# EAGLE design RPi BUS-Controller V1.0 (EAGLE 6.1)
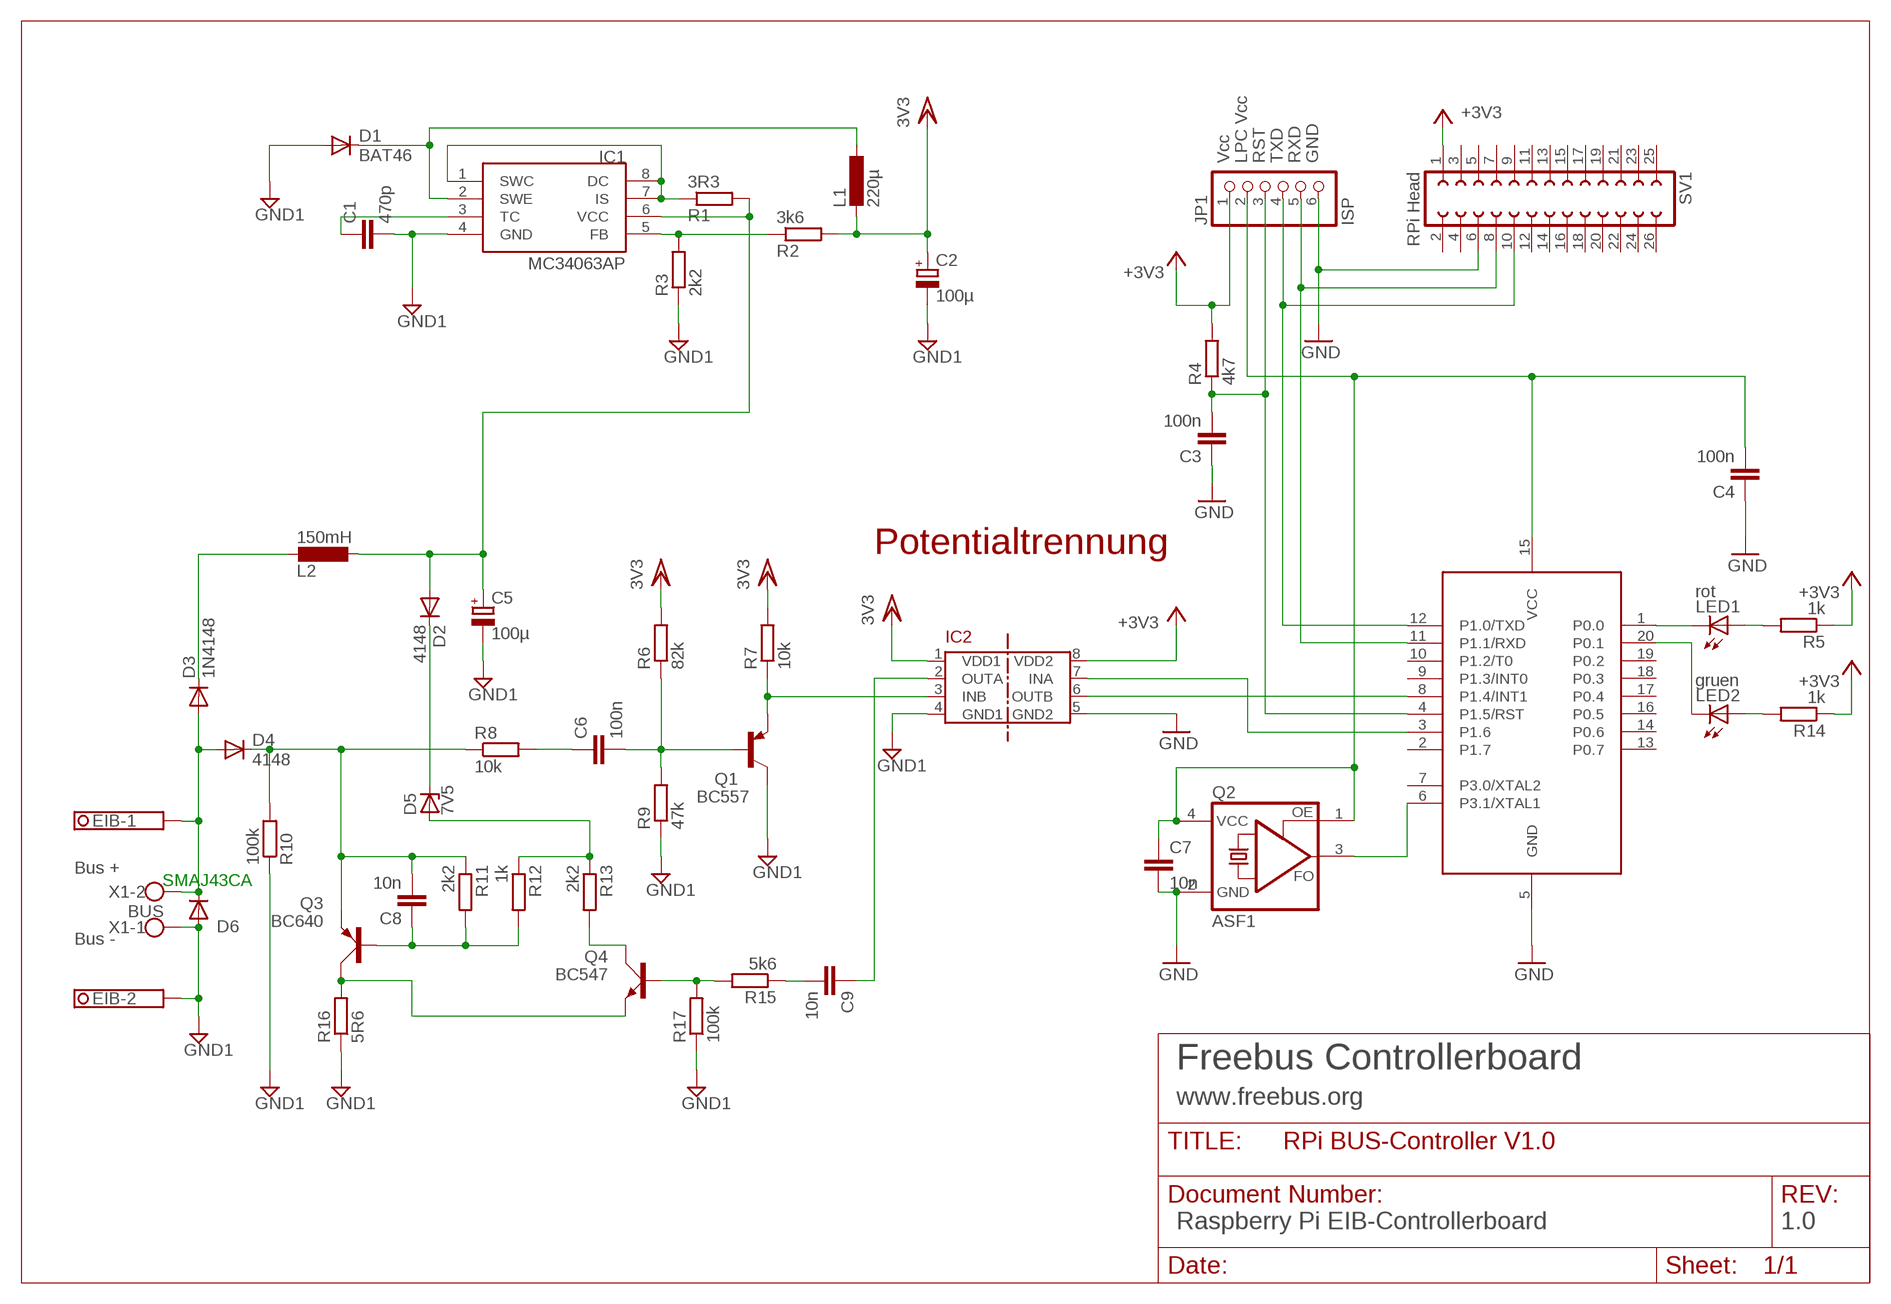
[diagram p0: schematic, sheet 1]

## Parts
C1  470p  C-EU025-024X044  [C025-024X044]
C2  100µ  RCL_C_EU_H2-5X11  [2-5X11]
C3  100n  C-EU025-024X044  [C025-024X044]
C4  100n  C-EU025-024X044  [C025-024X044]
C5  100µ  RCL_C_EU_H3,5-8X13  [3,5-8X13]
C6  100n  C-EU025-024X044  [C025-024X044]
C7  10n  C-EU025-024X044  [C025-024X044]
C8  10n  C-EU025-024X044  [C025-024X044]
C9  10n  C-EU025-024X044  [C025-024X044]
D1  BAT46  1N4148DO35-7  [DO35-7]
D2  4148  1N4148DO35-7  [DO35-7]
D3  1N4148  1N4148DO35-7  [DO35-7]
D4  4148  1N4148DO35-7  [DO35-7]
D5  7V5  ZPD"  [DO35Z7]
D6  SMAJ43CA  D-SMB  [SMB]
EIB  1751248  [1751248]
IC1  MC34063AP  [DIL08]
IC2  ADUM1201  [SO8]
IC3  89LPC922  [DIL20]
JP1  ISP  PINHD-1X6  [1X06]
L1  220µ  L-EU0207/12  [0207/12]
L2  150mH  RCL_L-11P11PH  [RCL_11PH]
LED1  rot  LED3MM  [LED3MM]
LED2  gruen  LED3MM  [LED3MM]
Q1  BC557  [TO92]
Q2  ASF1  [ASF]
Q3  BC640  [SOT54D]
Q4  BC547  [SOT54A]
R1  3R3  R-EU_0207/7  [0207/7]
R2  3k6  R-EU_0207/7  [0207/7]
R3  2k2  R-EU_0207/7  [0207/7]
R4  4k7  R-EU_0207/7  [0207/7]
R5  1k  R-EU_0207/7  [0207/7]
R6  82k  R-EU_0207/7  [0207/7]
R7  10k  R-EU_0207/7  [0207/7]
R8  10k  R-EU_0207/7  [0207/7]
R9  47k  R-EU_0207/7  [0207/7]
R10  100k  R-EU_0207/7  [0207/7]
R11  2k2  R-EU_0207/7  [0207/7]
R12  1k  R-EU_0207/7  [0207/7]
R13  2k2  R-EU_0207/7  [0207/7]
R14  1k  R-EU_0207/7  [0207/7]
R15  5k6  R-EU_0207/7  [0207/7]
R16  5R6  R-EU_0207/7  [0207/7]
R17  100k  R-EU_0207/7  [0207/7]
SV1  RPi Head  FE13-2  [FE13-2]
X1  BUS  W237-02P  [W237-132]

## Nets
/RESET: C3.2 IC3.4(P1.5/RST) JP1.3 R4.1
BASE: C6.2 Q1.2(B) R6.1 R9.2
EIB+: D3.A D4.A D6.1(C) EIB.1 X1.2
FETGATE: Q4.B R15.2 R17.2
GND1: C1.2 C2.- C5.- D1.A D6.2(A) EIB.2 IC1.4(GND) IC2.4(GND1) Q1.3(C) R3.1 R9.1 R10.1 R16.1 R17.1 X1.1
GND2: C3.1 C4.1 C7.2 IC2.5(GND2) IC3.5(GND) JP1.6 Q2.2(GND) SV1.6 ; supply symbol labelled GND
N$1: Q4.C R13.2
N$2: IC2.3(INB) Q1.1(E) R7.1
N$3: IC3.6(P3.1/XTAL1) Q2.3(FO)
N$4: D2.C D5.C
N$7: IC2.7(INA) IC3.3(P1.6)
N$8: IC1.1(SWC) IC1.7(IS) IC1.8(DC) R1.1
N$10: IC3.1(P0.0) LED1.K(C)
N$11: IC1.5(FB) R2.1 R3.2
N$12: D1.C IC1.2(SWE) L1.1
N$13: D3.C L2.P$2
N$14: C1.1 IC1.3(TC)
N$16: C6.1 R8.2
N$17: C9.2 R15.1
N$18: Q3.C Q4.E R16.2
N$19: IC3.20(P0.1) LED2.K(C)
N$20: C9.1 IC2.2(OUTA)
N$21: LED2.A R14.2
N$25: D5.A R12.1 R13.1
N$28: C8.1 Q3.B R11.2 R12.2
N$29: IC3.12(P1.0/TXD) JP1.4 SV1.10
N$30: IC3.11(P1.1/RXD) JP1.5 SV1.8
N$41: LED1.A R5.2
SIGIN: IC2.6(OUTB) IC3.8(P1.4/INT1)
V+: C8.2 D4.C Q3.E R8.1 R10.2 R11.1
VCC: C4.2 C7.1 IC3.15(VCC) JP1.2 Q2.1(OE) Q2.4(VCC)
VDC: C5.+ D2.A IC1.6(VCC) L2.P$1 R1.2
VDD1: C2.+ IC2.1(VDD1) L1.2 R2.2 R6.2 R7.2 ; supply symbol labelled 3V3
VDD2: IC2.8(VDD2) JP1.1 R4.2 R5.1 R14.1 SV1.1 ; supply symbol labelled +3V3
Unconnected: IC3.2(P1.7) IC3.7(P3.0/XTAL2) IC3.9(P1.3/INT0) IC3.10(P1.2/T0) IC3.13(P0.7) IC3.14(P0.6) IC3.16(P0.5) IC3.17(P0.4) IC3.18(P0.3) IC3.19(P0.2) SV1.2 SV1.3 SV1.4 SV1.5 SV1.7 SV1.9 SV1.11 SV1.12 SV1.13 SV1.14 SV1.15 SV1.16 SV1.17 SV1.18 SV1.19 SV1.20 SV1.21 SV1.22 SV1.23 SV1.24 SV1.25 SV1.26

## Notes on the sheet
- Vcc | LPC Vcc | RST | TXD | RXD | GND
- Potentialtrennung
- Bus + | SMAJ43CA
- Bus -
- Freebus Controllerboard
- www.freebus.org
- Raspberry Pi EIB-Controllerboard | 1.0

## Library data of the parts
C1 C3 C4 C6-C9 = rcl:C-EU: CAPACITOR, European symbol
C2 C5 = LPC_Gira3:RCL_C_EU_H
D1-D4 = diode:1N4148: DIODE high speed (Philips)
D5 = diode:ZPD: Z DIODE 500 mW
D6 = semicon-smd-ipc:D-: DIODE unfilled
EIB = con-phoenix-350:1751248: MKDS 1/ 2-3,5 Printklemme Nennstrom: 10 A Bemessungsspannung: 160 V Raster: 3,5 mm Polzahl: 2 Montageart: Löten Anschlussart: Schraubanschluss Anschlussrichtung vom Leiter zur Platine: 0° Source: http://eshop.phoenixcontact.com .. 1751248.pdf
IC1 = mc34063:MC34063
IC2 = Bus-isolators:ADUM1201
IC3 = micro-philips:89LPC922
JP1 = pinhead:PINHD-1X6: PIN HEADER
L1 = rcl:L-EU: INDUCTOR, European symbol
L2 = LPC_Gira3:RCL_L-11P
LED1 LED2 = led:LED: LED OSRAM: - CHIPLED LG R971, LG N971, LY N971, LG Q971, LY Q971, LO R971, LY R971 LH N974, LH R974 LS Q976, LO Q976, LY Q976 LO Q996 - Hyper CHIPLED LW Q18S LB Q993, LB Q99A, LB R99A - SideLED LS A670, LO A670, LY A670, LG A670, LP A670 LB A673, LV A673, LT A673, LW A673 LH A674 LY A675 LS A676, LA A676, LO A676, LY A676, LW A676 LS A679, LY A679, LG A679 - Hyper Micro SIDELED® LS Y876, LA Y876, LO Y876, LY Y876 LT Y87S - SmartLED LW L88C, LW L88S LB L89C, LB L89S, LG L890 LS L89K, LO L89K, LY L89K LS L896, LA L896, LO L896, LY L896 - TOPLED LS T670, LO T670, LY T670, LG T670, LP T670 LSG T670, LSP T670, LSY T670, LOP T670, LYG T670 LG T671, LOG T671, LSG T671 LB T673, LV T673, LT T673, LW T673 LH T674 LS T676, LA T676, LO T676, LY T676, LB T676, LH T676, LSB T676, LW T676 LB T67C, LV T67C, LT T67C, LS T67K, LO T67K, LY T67K, LW E67C LS E67B, LA E67B, LO E67B, LY E67B, LB E67C, LV E67C, LT E67C LW T67C LS T679, LY T679, LG T679 LS T770, LO T770, LY T770, LG T770, LP T770 LB T773, LV T773, LT T773, LW T773 LH T774 LS E675, LA E675, LY E675, LS T675 LS T776, LA T776, LO T776, LY T776, LB T776 LHGB T686 LT T68C, LB T68C - Hyper Mini TOPLED® LB M676 - Mini TOPLED Santana® LG M470 LS M47K, LO M47K, LY M47K Source: http://www.osram.convergy.de - LUMILED® LXK2-PW12-R00, LXK2-PW12-S00, LXK2-PW14-U00, LXK2-PW14-V00 LXK2-PM12-R00, LXK2-PM12-S00, LXK2-PM14-U00 LXK2-PE12-Q00, LXK2-PE12-R00, LXK2-PE12-S00, LXK2-PE14-T00, LXK2-PE14-U00 LXK2-PB12-K00, LXK2-PB12-L00, LXK2-PB12-M00, LXK2-PB14-N00, LXK2-PB14-P00, LXK2-PB14-Q00 LXK2-PR12-L00, LXK2-PR12-M00, LXK2-PR14-Q00, LXK2-PR14-R00 LXK2-PD12-Q00, LXK2-PD12-R00, LXK2-PD12-S00 LXK2-PH12-R00, LXK2-PH12-S00 LXK2-PL12-P00, LXK2-PL12-Q00, LXK2-PL12-R00 Source: www.luxeon.com
Q1 = transistor-pnp:BC557: PNP Transistor
Q2 = crystal:ASF*: CRYSTAL CLOCK OSCILLATORS 5.0 Vdc or 3.3 Vdc - LOW PROFILE ULTRA MINIATURE CERAMIC SURFACE MOUNT Source: http://www.abracon.com/Oscillators/asf1-L-L1.pdf
Q3 = transistor-small-signal:BC640: PNP TRANSISTOR
Q4 = transistor-small-signal:BC547: NPN TRANSISTOR
R1-R17 = rcl:R-EU_: RESISTOR, European symbol
SV1 = con-lsta:FE13-2: FEMALE HEADER
X1 = con-wago-508:W237-02P: WAGO SREW CLAMP

## Board
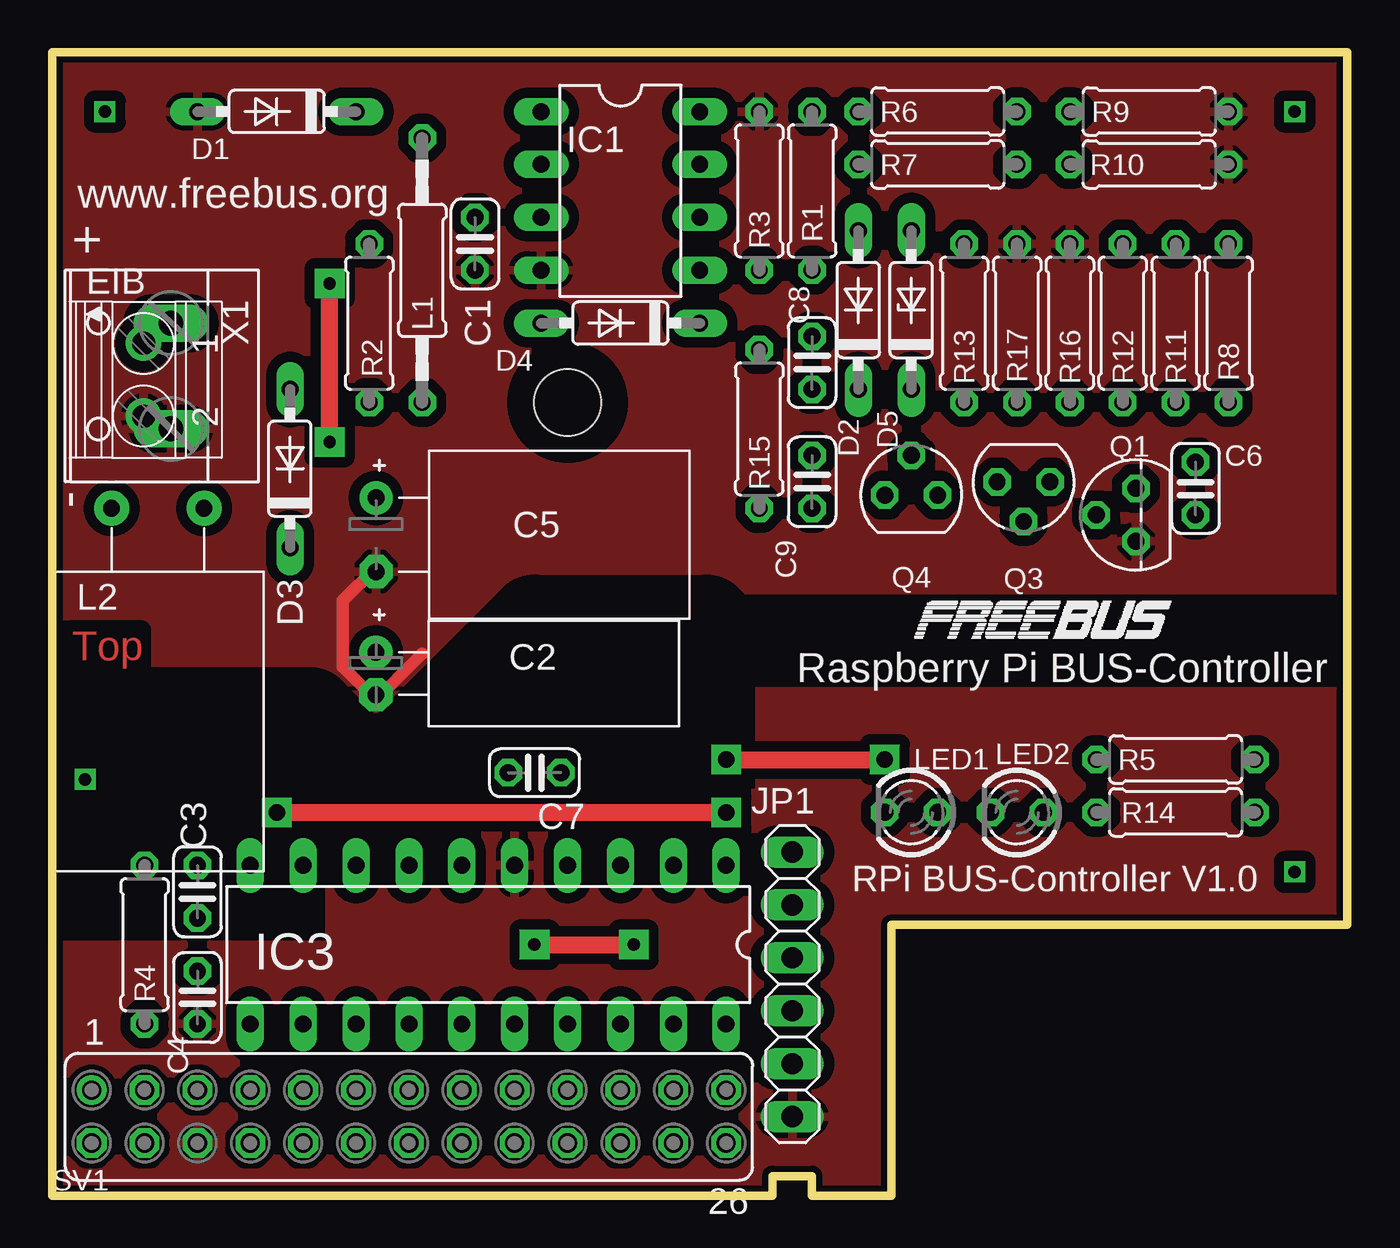
[diagram p1: board, top side]
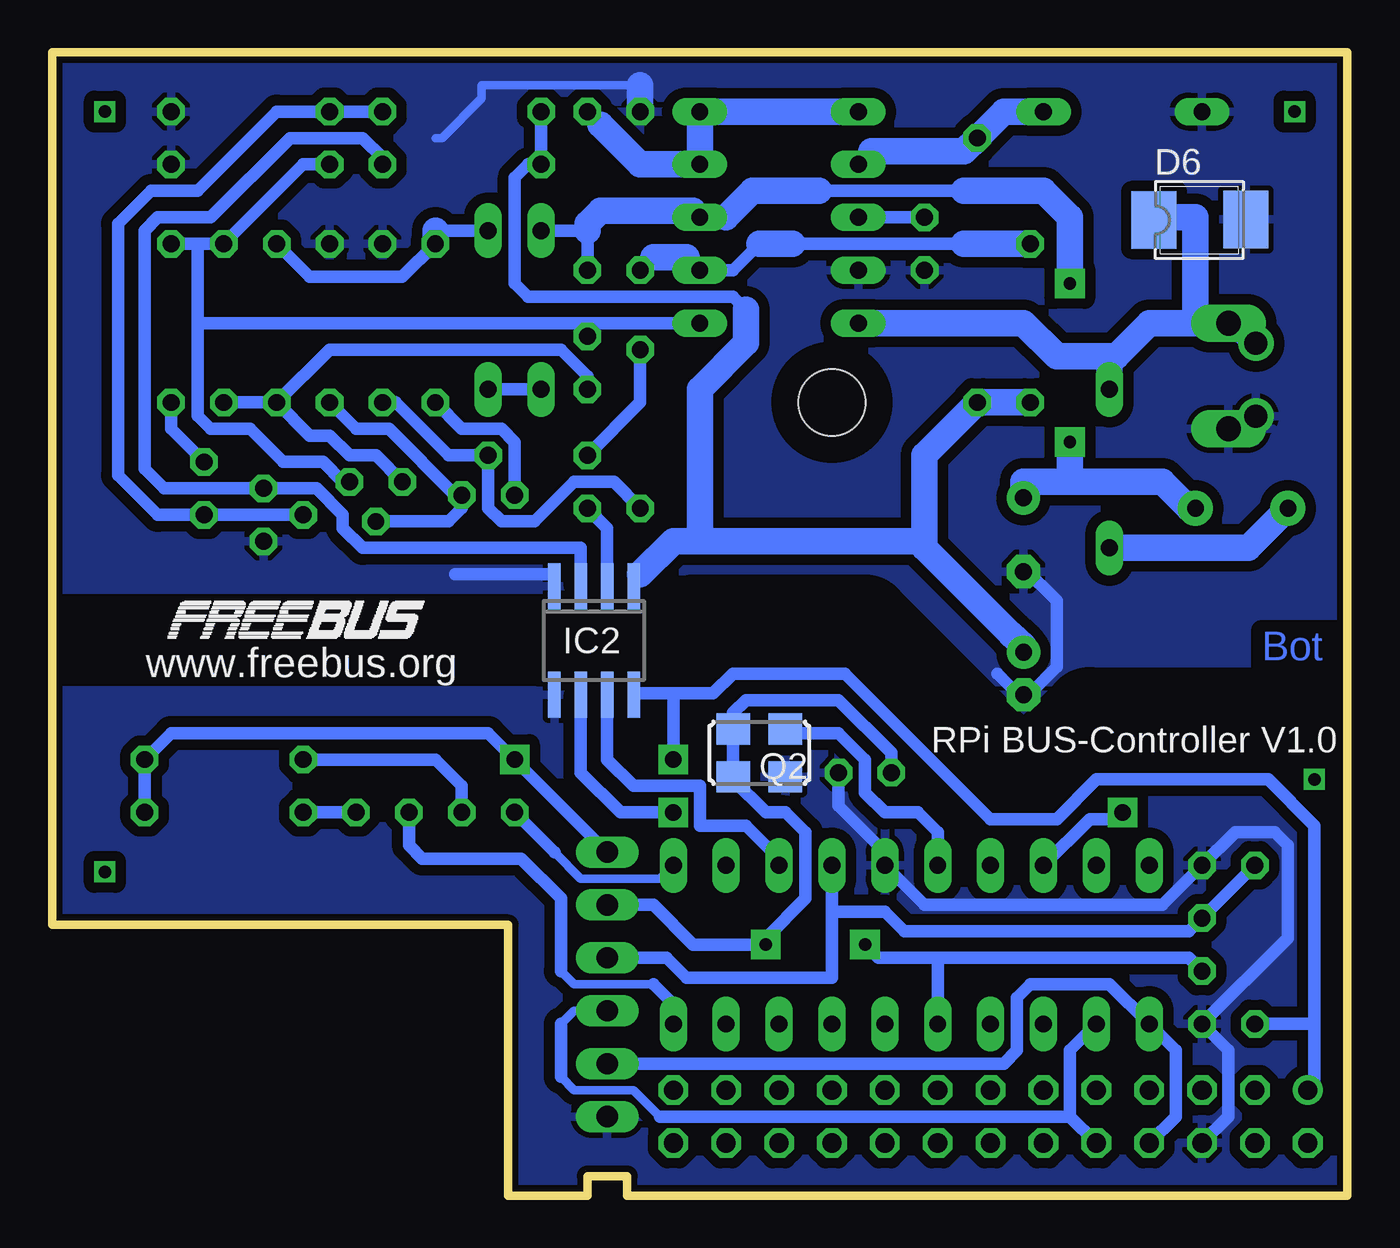
[diagram p2: board, bottom side, seen from below]

Size 62.23 x 54.93 mm. Coordinates in mm from the lower left corner, seen from the top.
Outline: 0,0 34.61,0 34.61,0.95 36.51,0.95 36.51,0 40.32,0 40.32,13.02 62.23,13.02 62.23,54.93 0,54.93 0,0
Copper layers (1*16): Top 0.035mm / dielectric 1.5mm / Bottom 0.035mm
Design rules: minimum track width 16mil, minimum drill 24mil, track to track 20mil, track to pad 10mil, pad to pad 10mil, via to via 10mil, smd to smd 10mil, copper to edge 4mil, drill to drill 8mil, minimum pad ring 10mil, minimum via ring 8mil, stop-mask expansion 4mil, vias tented up to drill 0mil, thermal gap 10mil
Holes 3.2 mm at 24.77,38.1
tRestrict: area 22.7,36 to 26.9,40.2; 7 lines
bRestrict: area 22.7,36 to 26.9,40.2; 8 lines
vRestrict: area 36.8,45.7 to 53.3,55.9; area 57.1,33 to 64.8,55.9; area 10.2,45.7 to 16.5,52.1; area 10.2,16.5 to 15.2,39.4

### Footprints (pad centres in the part's own frame; a part is rotated, then mirrored left to right if it is on the bottom)
C025-024X044 = drill 0.813 octagon: 1 -1.27,0; 2 1.27,0
2-5X11 = drill 0.813 pad 1.6: + -1.02,0 | drill 0.813 pad 1.6 octagon: - 1.02,0
3,5-8X13 = drill 0.813 pad 1.6: + -1.77,-0.31 | drill 0.813 pad 1.6 octagon: - 1.77,-0.31
DO35-7 = drill 0.813 long: A 3.81,0; C -3.81,0
DO35Z7 = drill 0.813 long: A 3.81,0; C -3.81,0
SMB = smd 2.159 x 2.743: 1 -2.311,-0.127; 2 2.108,-0.102
1751248 = drill 1.1 pad 1.7: 1 -1.75,-0.1; 2 1.75,-0.1
DIL08 = drill 0.813 long: 1 -3.81,-3.81; 2 -1.27,-3.81; 3 1.27,-3.81; 4 3.81,-3.81; 5 3.81,3.81; 6 1.27,3.81; 7 -1.27,3.81; 8 -3.81,3.81
SO8 = smd 0.6 x 2.2: 1 -1.905,-2.6; 2 -0.635,-2.6; 3 0.635,-2.6; 4 1.905,-2.6; 5 1.905,2.6; 6 0.635,2.6; 7 -0.635,2.6; 8 -1.905,2.6
DIL20 = drill 0.813 long: 1 -11.43,-3.81; 2 -8.89,-3.81; 3 -6.35,-3.81; 4 -3.81,-3.81; 5 -1.27,-3.81; 6 1.27,-3.81; 7 3.81,-3.81; 8 6.35,-3.81; 9 8.89,-3.81; 10 11.43,-3.81; 11 11.43,3.81; 12 8.89,3.81; 13 6.35,3.81; 14 3.81,3.81; 15 1.27,3.81; 16 -1.27,3.81; 17 -3.81,3.81; 18 -6.35,3.81; 19 -8.89,3.81; 20 -11.43,3.81
1X06 = drill 1.016 long: 1 -6.35,0; 2 -3.81,0; 3 -1.27,0; 4 1.27,0; 5 3.81,0; 6 6.35,0
0207/12 = drill 0.813 octagon: 1 -6.35,0; 2 6.35,0
RCL_11PH = drill 0.8 pad 1.676: P$1 -2.223,0; P$2 2.223,0
LED3MM = drill 0.813 octagon: A -1.27,0; K 1.27,0
TO92 = drill 0.813 octagon: 1 1.27,0; 2 0,1.905; 3 -1.27,0
ASF = smd 1.6 x 1.5: 1 -1.25,-1.15; 2 1.25,-1.15; 3 1.25,1.15; 4 -1.25,1.15
SOT54D = drill 0.813 octagon: B 1.27,0; C 0,1.905; E -1.27,0
SOT54A = drill 0.813 octagon: B 0,1.905; C -1.27,0; E 1.27,0
0207/7 = drill 0.813 octagon: 1 -3.81,0; 2 3.81,0
FE13-2 = drill 0.914: 1 -15.24,1.27 | drill 0.914 octagon: 2 -15.24,-1.27; 3 -12.7,1.27; 4 -12.7,-1.27; 5 -10.16,1.27; 6 -10.16,-1.27; 7 -7.62,1.27; 8 -7.62,-1.27; 9 -5.08,1.27; 10 -5.08,-1.27; 11 -2.54,1.27; 12 -2.54,-1.27; 13 0,1.27; 14 0,-1.27; 15 2.54,1.27; 16 2.54,-1.27; 17 5.08,1.27; 18 5.08,-1.27; 19 7.62,1.27; 20 7.62,-1.27; 21 10.16,1.27; 22 10.16,-1.27; 23 12.7,1.27; 24 12.7,-1.27; 25 15.24,1.27; 26 15.24,-1.27
W237-132 = drill 1.194 long: 1 -2.54,-0.635; 2 2.54,-0.635

### Placement (x,y rotation side)
C1  20.32,45.72 270 top
C2  15.56,25.08 270 top
C3  6.99,14.61 270 top
C4  6.99,9.53 90 top
C5  15.88,31.75 270 top
C6  54.93,33.97 270 top
C7  23.18,20.32 0 top
C8  36.51,40.01 90 top
C9  36.51,34.29 90 top
D1  10.79,52.07 180 top
D2  38.73,42.55 90 top
D3  11.43,34.92 90 top
D4  27.3,41.91 180 top
D5  41.27,42.55 90 top
D6  6.99,46.99 0 bottom
EIB  4.5,39.19 270 top
IC1  27.3,48.26 270 top
IC2  36.2,26.67 180 bottom
IC3  20.95,12.06 180 top
JP1  35.56,10.16 270 top
L1  17.78,44.45 270 top
L2  5.08,33.02 180 top
LED1  41.27,18.41 180 top
LED2  46.35,18.41 180 top
Q1  52.07,32.7 90 top
Q2  28.26,21.27 0 bottom
Q3  46.67,34.29 180 top
Q4  41.27,33.66 0 top
R1  36.51,48.26 270 top
R2  15.24,41.91 270 top
R3  33.97,48.26 270 top
R4  4.45,12.06 270 top
R5  53.98,20.95 180 top
R6  42.55,52.07 180 top
R7  42.55,49.53 180 top
R8  56.52,41.91 270 top
R9  52.7,52.07 180 top
R10  52.7,49.53 180 top
R11  53.98,41.91 270 top
R12  51.44,41.91 270 top
R13  43.81,41.91 270 top
R14  53.98,18.41 180 top
R15  33.97,36.83 270 top
R16  48.9,41.91 270 top
R17  46.35,41.91 270 top
SV1  17.14,3.81 0 top
X1  5.08,39.37 90 top

### Tracks (layer width: path | path; a pad name or v marks a point on that pad's centre or on a via)
/RESET
  Bottom 0.61: R4.1 C3.2 7.62,12.7 21.27,12.7 22.23,13.65 24.77,13.65 | 24.77,13.65 IC3.4 | JP1.3 32.7,11.43 31.75,10.48 24.77,10.48 24.77,13.65
BASE
  Bottom 0.61: Q1.2 C6.2 57.15,32.7 59.05,34.61 59.05,46.67 57.47,48.26 55.24,48.26 51.44,52.07 R9.2 R6.1
EIB+
  Bottom 0.406: 9.65,46.99 D6.1 | EIB.1 4.45,41.27 5.08,41.91 X1.2
  Bottom 1.27: 7.3,41.91 7.3,46.99 9.65,46.99 | 7.3,41.91 X1.2 5.4,41.91 4.45,40.96 | 7.3,41.91 9.53,41.91 11.11,40.32 11.43,40.32 | 11.43,40.32 D3.A | 11.43,40.32 13.97,40.32 15.56,41.91 D4.A
FETGATE
  Bottom 0.61: R15.2 35.24,34.29 37.15,34.29 39.05,32.38 40.64,32.38 41.27,33.02 Q4.B 43.18,35.56 45.72,38.1 R17.2
GND1
  Top 0.61: 15.56,30.16 13.97,28.57 13.97,25.4 15.24,24.13 15.88,24.13 17.78,26.04
  Bottom 0.406: 33.97,53.34 41.59,53.34 41.59,52.7 43.5,50.8 43.81,50.8 | 15.24,24.13 C2.-
  Bottom 0.61: IC2.4 38.1,29.84 42.86,29.84 | 15.56,30.16 13.97,28.57 13.97,25.4 15.24,24.13 15.88,24.13 16.83,25.08
  Bottom 1.27: R3.1 33.97,53.34 | X1.1 5.08,36.83 4.45,37.47
  pour Bottom (isolate 0.305): 15.88,22.23 13.34,24.77 0,24.77 0,54.93 62.23,54.93 62.23,28.26 39.05,28.26 39.05,27.3 33.66,27.3 31.75,29.21 22.86,29.21
  pour Top (isolate 0.305): 0,24.77 0,54.93 62.23,54.93 62.23,28.26 32.7,28.26 31.75,29.21 22.86,29.21 15.88,22.23 13.34,24.77
GND2
  Bottom 0.406: IC3.5 22.23,16.51
  Bottom 0.61: SV1.6 5.71,3.81 5.71,6.99 C4.1 2.86,12.38 2.86,16.83 3.49,17.46 5.4,17.46 C3.1 8.89,13.97 20.32,13.97 IC3.5 | 22.23,16.51 24.45,18.73 C7.2
  pour Bottom (isolate 0.305): 0,21.59 12.06,21.59 14.61,19.05 16.83,19.05 23.81,26.04 30.8,26.04 31.75,25.08 33.02,25.08 33.02,25.72 39.05,25.72 39.05,25.08 62.23,25.08 62.23,13.02 40.32,13.02 40.32,0 36.51,0 36.51,0.95 34.61,0.95 34.61,0 0,0
  pour Top (isolate 0.305): 0,12.06 13.34,12.06 13.34,19.37 33.97,19.37 33.97,25.4 62.23,25.08 62.23,13.02 40.32,13.02 40.32,0 36.51,0 36.51,0.95 34.61,0.95 34.61,0 0,0
N$1
  Bottom 0.61: Q4.C 40.01,36.2 40.64,36.83 42.55,36.83 R13.2
N$2
  Bottom 0.61: IC2.3 36.83,31.11 47.31,31.11 48.26,32.07 48.26,32.7 49.53,33.97 Q1.1 56.83,33.97 57.78,34.92 57.78,46.35 57.15,46.99 54.61,46.99 50.8,50.8 47.31,50.8 46.35,49.85 R7.1
N$3
  Bottom 0.406: 26.81,22.23 Q2.3
  Bottom 0.61: IC3.6 19.68,17.46 20.64,18.41 22.23,18.41 23.18,19.37 23.18,20.95 24.45,22.23 26.81,22.23
N$4
  Bottom 0.61: D2.C D5.C
N$7
  Bottom 0.61: IC2.7 35.56,20.95 34.29,19.68 31.11,19.68 31.11,17.78 28.89,17.78 27.3,16.19 IC3.3
N$8
  Bottom 0.61: 35.88,51.44 R1.1
  Bottom 1.27: IC1.1 IC1.8 IC1.7 33.97,49.53 35.88,51.44
N$10
  Bottom 0.406: 38.1,16.51 36.83,15.24 33.02,15.24 IC3.1
  Bottom 0.61: LED1.K 38.1,16.51
N$11
  Bottom 0.61: 33.34,45.09 R3.2 | 31.75,45.09 IC1.5 29.53,44.45 28.26,45.72 | 18.41,45.72 26.67,45.72
  Bottom 1.27: 31.75,45.09 33.34,45.09 | R2.1 18.41,45.72 | 26.67,45.72 28.26,45.72
N$12
  Bottom 0.61: 22.86,50.16 IC1.2
  Bottom 1.27: 22.86,50.16 18.41,50.16 L1.1 16.51,52.07 D1.C
N$13
  Bottom 1.27: D3.C 4.76,31.11 L2.P$2
N$14
  Bottom 0.61: C1.1 IC1.3
N$16
  Bottom 0.61: C6.1 56.52,36.83 R8.2
N$17
  Bottom 0.61: C9.2 33.97,38.1 R15.1
N$18
  Bottom 0.406: 42.86,33.66 Q4.E
  Bottom 0.61: R16.2 47.62,36.83 46.04,36.83 42.86,33.66 | Q3.C 43.18,32.38 42.55,33.02 Q4.E
N$19
  Bottom 0.406: 37.78,10.79 37.15,10.16 33.34,10.16
  Bottom 0.61: LED2.K 45.09,16.83 44.45,16.19 39.69,16.19 37.78,14.29 37.78,10.79 | 33.34,10.16 32.38,9.21 IC3.20
N$20
  Bottom 0.61: C9.1 35.56,32.07 IC2.2
N$21
  Bottom 0.61: LED2.A R14.2
N$25
  Bottom 0.61: R13.1 45.4,44.13 49.85,44.13 R12.1 | 43.81,46.35 D5.A
  Bottom 1.27: R13.1 43.81,46.35
N$28
  Bottom 0.61: C8.1 36.51,39.37 37.78,40.64 48.9,40.64 R12.2 | R12.2 49.85,36.51 48.9,36.51 47.94,35.56 46.67,35.56 Q3.B | R12.2 R11.2
N$29
  Bottom 0.406: 33.02,3.81 34.29,5.08 37.15,5.08 37.78,5.71 | 37.78,8.26 37.15,8.89 JP1.4
  Bottom 0.61: SV1.10 13.34,3.81 | 13.34,3.81 13.34,6.99 IC3.12 | 13.34,3.81 33.02,3.81 | 37.78,5.71 37.78,8.26
N$30
  Bottom 0.61: SV1.8 8.26,3.81 8.26,6.99 IC3.11 11.43,10.16 15.24,10.16 15.88,9.53 15.88,6.99 16.51,6.35 JP1.5
N$41
  Bottom 0.61: LED1.A 42.55,19.68 43.81,20.95 R5.2
S$1  (via drill 0.6)
  other vias: 59.69,15.56
S$2  (via drill 0.6)
  other vias: 1.59,20
S$3  (via drill 0.6)
  other vias: 59.69,52.07
S$4  (via drill 0.6)
  other vias: 2.54,52.07
SIGIN  (via drill 0.8 pad 1.42)
  Top 0.813: v10.79,18.41 v32.38,18.41
  Bottom 0.61: IC2.6 36.83,20.32 34.92,18.41 v32.38,18.41 | IC3.8 12.38,18.1 11.11,18.1 v10.79,18.41
V+
  Bottom 0.61: D4.C 36.51,41.91 | 36.51,41.91 C8.2 | 55.24,45.72 55.24,41.91 | 55.24,41.91 36.51,41.91 | Q3.E 48.26,34.29 49.21,35.24 51.12,35.24 52.7,36.83 54.61,36.83 55.24,37.47 55.24,41.91 | R10.2 50.16,49.53 R11.1 55.24,45.72 | R8.1 55.24,45.72
VCC  (via drill 0.6 pad 1.42)
  Top 0.813: v23.18,12.06 v27.94,12.06
  Bottom 0.406: 29.53,20.32 Q2.1 29.51,19.98 | 29.53,22.09 Q2.4
  Bottom 0.61: C4.2 7.62,11.43 19.68,11.43 | 19.68,11.43 IC3.15 | 19.68,11.43 22.54,11.43 v23.18,12.06 | 29.53,20.32 29.53,22.09 | 29.51,19.98 27.94,18.41 26.99,18.41 26.04,17.46 26.04,14.29 27.94,12.38 v27.94,12.06 31.43,12.06 33.34,13.97 JP1.2 | Q2.4 29.51,23.2 28.89,23.81 24.45,23.81 21.91,21.27 C7.1
VDC  (via drill 0.6 pad 1.42)
  Top 0.813: v13.34,36.2 v13.34,43.81
  Bottom 0.61: R1.2 36.51,46.35 D2.A | 18.41,48.26 25.4,48.26
  Bottom 1.016: 31.43,47.31 IC1.6 29.84,46.99
  Bottom 1.27: 31.43,47.31 35.88,47.31 36.51,46.67 36.51,46.35 | 29.84,46.99 28.57,48.26 25.4,48.26 | 18.41,48.26 14.61,48.26 13.34,46.99 v13.34,43.81 | 13.34,34.29 8.89,34.29 7.62,33.02 L2.P$1 | 13.34,34.29 15.56,34.29 C5.+ | 13.34,34.29 v13.34,36.2
VDD1
  Bottom 0.406: 34.29,29.84 IC2.1
  Bottom 0.61: 33.97,29.84 34.29,29.84 | 28.89,42.55 29.53,43.18 39.37,43.18 40.01,43.81 40.01,48.9 39.37,49.53 R7.2 R6.2
  Bottom 1.27: 31.11,31.43 32.38,31.43 33.97,29.84 | 31.11,31.43 31.11,38.73 28.89,40.96 28.89,42.55 | C2.+ 15.56,26.42 16.19,26.99 20.32,31.11 20.32,31.43 | 20.32,31.43 20.32,35.56 L1.2 R2.2 | 20.32,31.43 31.11,31.43
VDD2  (via drill 0.8 pad 1.42)
  Top 0.813: v32.38,20.95 v40.01,20.95
  Bottom 0.406: 34.29,24.13 IC2.8
  Bottom 0.61: R14.1 R5.1 56.52,22.23 41.27,22.23 v40.01,20.95 JP1.1 | SV1.1 1.59,5.4 1.59,8.26 | 32.38,24.13 30.48,24.13 29.53,25.08 24.13,25.08 17.14,18.1 13.97,18.1 12.06,20 3.81,20 1.59,17.78 1.59,8.26 | 1.59,8.26 R4.2 | 32.38,24.13 34.29,24.13 | 32.38,24.13 v32.38,20.95

### Text on the board
Top: Top
Bottom: Bot
tPlace: + | -
tNames: www.freebus.org | Raspberry Pi BUS-Controller
bNames: www.freebus.org